# Altium schematic sheet BoardB-Camera.SchDoc
size A; SheetNumber: 7; SheetTotal: 9
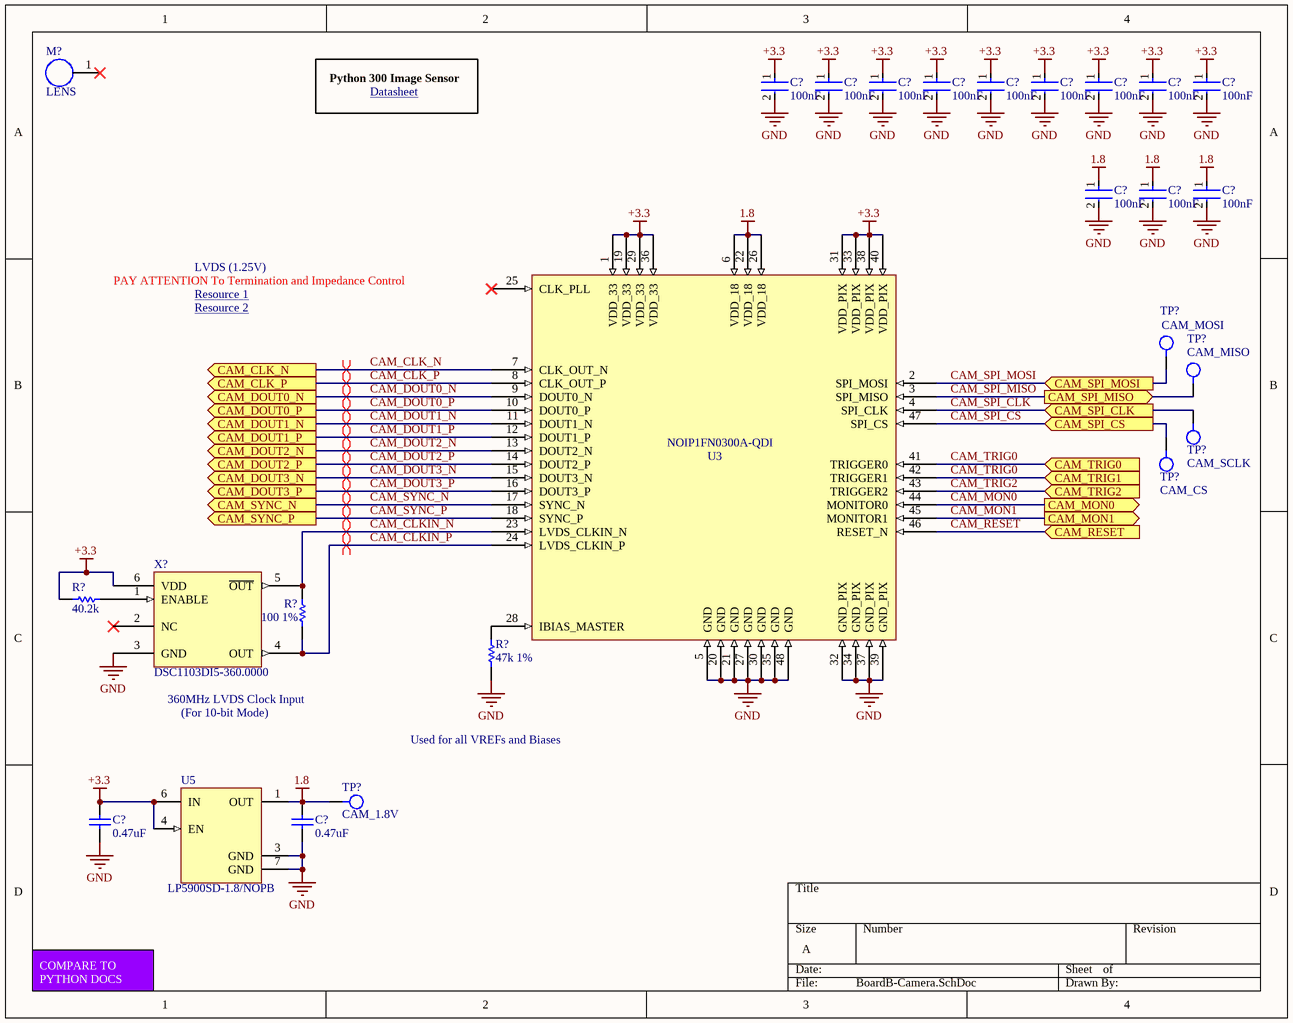
[diagram p0: BoardB-Camera.SchDoc]

## Parts
(Parts that share a designator on the sheet are numbered #1, #2 ... from top to bottom, then left to right.)
C?#1  100nF  [FP-C0402-BB-MFG]
C?#2  100nF  [FP-C0402-BB-MFG]
C?#3  100nF  [FP-C0402-BB-MFG]
C?#4  100nF  [FP-C0402-BB-MFG]
C?#5  100nF  [FP-C0402-BB-MFG]
C?#6  100nF  [FP-C0402-BB-MFG]
C?#7  100nF  [FP-C0402-BB-MFG]
C?#8  100nF  [FP-C0402-BB-MFG]
C?#9  100nF  [FP-C0402-BB-MFG]
C?#10  100nF  [FP-C0402-BB-MFG]
C?#11  100nF  [FP-C0402-BB-MFG]
C?#12  100nF  [FP-C0402-BB-MFG]
C?#13  0.47uF  [CAPC1050X55X10LL05]
C?#14  0.47uF  [CAPC1050X55X10LL05]
M?  LENS  [LENS_MNT]
R?#1  40.2k  [RESC1005X40X25LL05T05]
R?#2  100 1%  [RESC1005X40X25LL05T05]
R?#3  47k 1%  [RESC1005X40X25NL05T05]
TP?#1  CAM_MOSI
TP?#2  CAM_MISO
TP?#3  CAM_SCLK
TP?#4  CAM_CS
TP?#5  CAM_1.8V
U3  NOIP1FN0300A-QDI  [NOIP1FN0300A-QDI]
U5  LP5900SD-1.8/NOPB  [LP5900-WSON]
X?  DSC1103DI5-360.0000  [DSC1103DI5-360.0000]

## Ports
CAM_CLK_N (out), CAM_CLK_P (out), CAM_DOUT0_N (out), CAM_DOUT0_P (out), CAM_DOUT1_N (out), CAM_DOUT1_P (out), CAM_DOUT2_N (out), CAM_DOUT2_P (out), CAM_DOUT3_N (out), CAM_DOUT3_P (out), CAM_MON0 (out), CAM_MON1 (out), CAM_RESET (in), CAM_SPI_CLK (in), CAM_SPI_CS (in), CAM_SPI_MISO (out), CAM_SPI_MOSI (in), CAM_SYNC_N (out), CAM_SYNC_P (out), CAM_TRIG0 (in), CAM_TRIG1 (in), CAM_TRIG2 (in)

## Nets
1.8: C?#10.1 C?#11.1 C?#12.1 C?#14.2 TP?#5.1 U3.6(VDD_18) U3.22(VDD_18) U3.26(VDD_18) U5.1(OUT)
+3.3: C?#1.1 C?#2.1 C?#3.1 C?#4.1 C?#5.1 C?#6.1 C?#7.1 C?#8.1 C?#9.1 C?#13.2 R?#1.1 U3.1(VDD_33) U3.19(VDD_33) U3.29(VDD_33) U3.31(VDD_PIX) U3.33(VDD_PIX) U3.36(VDD_33) U3.38(VDD_PIX) U3.40(VDD_PIX) U5.4(EN) U5.6(IN) X?.6(VDD)
GND: C?#1.2 C?#2.2 C?#3.2 C?#4.2 C?#5.2 C?#6.2 C?#7.2 C?#8.2 C?#9.2 C?#10.2 C?#11.2 C?#12.2 C?#13.1 C?#14.1 R?#3.1 U3.5(GND) U3.20(GND) U3.21(GND) U3.27(GND) U3.30(GND) U3.32(GND_PIX) U3.34(GND_PIX) U3.35(GND) U3.37(GND_PIX) U3.39(GND_PIX) U3.48(GND) U5.3(GND) U5.7(GND) X?.3(GND)
CAM_CLK_N: U3.7(CLK_OUT_N) ; port CAM_CLK_N
CAM_CLK_P: U3.8(CLK_OUT_P) ; port CAM_CLK_P
CAM_CLKIN_N: R?#2.2 U3.23(LVDS_CLKIN_N) X?.5(~{OUT})
CAM_CLKIN_P: R?#2.1 U3.24(LVDS_CLKIN_P) X?.4(OUT)
CAM_DOUT0_N: U3.9(DOUT0_N) ; port CAM_DOUT0_N
CAM_DOUT0_P: U3.10(DOUT0_P) ; port CAM_DOUT0_P
CAM_DOUT1_N: U3.11(DOUT1_N) ; port CAM_DOUT1_N
CAM_DOUT1_P: U3.12(DOUT1_P) ; port CAM_DOUT1_P
CAM_DOUT2_N: U3.13(DOUT2_N) ; port CAM_DOUT2_N
CAM_DOUT2_P: U3.14(DOUT2_P) ; port CAM_DOUT2_P
CAM_DOUT3_N: U3.15(DOUT3_N) ; port CAM_DOUT3_N
CAM_DOUT3_P: U3.16(DOUT3_P) ; port CAM_DOUT3_P
CAM_MON0: U3.44(MONITOR0) ; port CAM_MON0
CAM_MON1: U3.45(MONITOR1) ; port CAM_MON1
CAM_RESET: U3.46(RESET_N) ; port CAM_RESET
CAM_SPI_CLK: TP?#3.1 U3.4(SPI_CLK) ; port CAM_SPI_CLK
CAM_SPI_CS: TP?#4.1 U3.47(SPI_CS) ; port CAM_SPI_CS
CAM_SPI_MISO: TP?#2.1 U3.3(SPI_MISO) ; port CAM_SPI_MISO
CAM_SPI_MOSI: TP?#1.1 U3.2(SPI_MOSI) ; port CAM_SPI_MOSI
CAM_SYNC_N: U3.17(SYNC_N) ; port CAM_SYNC_N
CAM_SYNC_P: U3.18(SYNC_P) ; port CAM_SYNC_P
CAM_TRIG0: U3.41(TRIGGER0) U3.42(TRIGGER1) ; port CAM_TRIG0, port CAM_TRIG1
CAM_TRIG2: U3.43(TRIGGER2) ; port CAM_TRIG2
NetR?#1_2: R?#1.2 X?.1(ENABLE)
NetR?#3_2: R?#3.2 U3.28(IBIAS_MASTER)

Not connected (* = marked no-connect by the designer): M? 1*; U3 25(CLK_PLL)*; X? 2(NC)*

## Layout directives
differential pair; differential pair class CAM_CLK_OUT: CAM_CLK_N, CAM_CLK_P
differential pair; differential pair class CAM_DOUT0: CAM_DOUT0_N, CAM_DOUT0_P
differential pair; differential pair class CAM_DOUT1: CAM_DOUT1_N, CAM_DOUT1_P
differential pair; differential pair class CAM_DOUT2: CAM_DOUT2_N, CAM_DOUT2_P
differential pair; differential pair class CAM_DOUT3: CAM_DOUT3_N, CAM_DOUT3_P
differential pair; differential pair class CAM_SYNC: CAM_SYNC_N, CAM_SYNC_P
differential pair; differential pair class CAM_CLKIN: CAM_CLKIN_N, CAM_CLKIN_P

## Notes on the sheet
- Python 300 Image Sensor
- Datasheet <https://www.onsemi.com/pdf/datasheet/noip1sn1300a-d.pdf>
- PAY ATTENTION To Termination and Impedance Control
- LVDS (1.25V)
- Resource 1 <https://www.xilinx.com/content/dam/xilinx/support/documentation/application_notes/xapp585-lvds-source-synch-serdes-clock-multiplication.pdf>
- Resource 2 <https://support.xilinx.com/s/article/43989?language=en_US>
- (near X?) 360MHz LVDS Clock Input
- (For 10-bit Mode)
- Used for all VREFs and Biases
- COMPARE TO PYTHON DOCS

## Library data of the parts
C?#1-C?#12 = CMP-2008-02046-2: CAP CER 0.1UF 10V X5R 0402; Manufacturer: Kemet; Manufacturer Part Number: C0402C104K8PACTU; Material: Ceramic; Capacitance: 0.10 μF; Temperature Coefficient: 15%; Tolerance: 0.1; Value: 0.10 μF; Package: C0402-BB; Temperature: -55°C to +125°C; ComponentLink2Description: Datasheet; Temperature Characteristic: X5R; Device Class L1: Passive Components; Height: 0.55mm; Lead Free: Yes; ComponentLink2URL: https://content.kemet.com/datasheets/KEM_C1002_X7R_SMD.pdf; Device Class L2: Capacitors; Temperature Range Low: -55°C; Temperature Range High: +125°C; RoHS: TRUE; Octopart: https://octopart.com/c0402c104k8pactu-kemet-140039; Automotive: No; Mouser Description: Capacitor 100 nF 10 VDC 0402; Category: Cap; Voltage Rating: 10 V; Digikey Description: CAP CER 0.1UF 10V X5R 0402; Ipc Land Pattern Name: CAPC10050X50; Device Class L3: Ceramic Capacitors
C?#13 C?#14 = CMP-2000-06003-1: Chip Capacitor, 0.47 uF, +/- 10%, 25 V, -55 to 85 degC, 0402 (1005 Metric), RoHS, Tape and Reel; PCN Part Number: MLCCPartNumberChange30/Nov/2012; Manufacturer: TDK; Kits: 445-9021-KIT-ND / -KITMLCC100PF-10UF04026.3-50V; Capacitance: 0.47µF; Other Names: 445-8020-1; Temperature Coefficient: X5R; Voltage - Rated: 25V; Product Training Modules: CSeriesGeneralApplicationsSEAT,CCV,andTVCLDesignToolsGuidetoReplacinganElectrolyticCapacitorwithanMLCC; EDA / CAD Models: DownloadfromAcceleratedDesigns; Online Catalog: CSeries,GeneralPurpose; Datasheet URL: https://product.tdk.com/info/en/catalog/datasheets/mlcc_commercial_general_en.pdf; Size / Dimension: 0.039"Lx0.020"W(1.00mmx0.50mm); Category: Capacitors; Mounting Technology: SurfaceMount; Mounting Type: SurfaceMount,MLCC; Series: C; RoHS Information: RoHSCertificate-MLCC; Manufacturer URL: http://www.tdk.com/; Packaging: CutTape(CT); Features: LowESL; Package / Case: 0402(1005Metric); Package Reference: 0402; Family: CeramicCapacitors; Tolerance: ±10%; Datasheet Version: 08/2016; Package Description: 2-Pin Surface Mount Device, Body 1.00 x 0.50 mm; Operating Temperature: -55°C~85°C; Standard Package: 1; Applications: GeneralPurpose
M? = LENS_MNT
R?#1 = CMP-2002-00919-1: Manufacturer: Panasonic; Part Number: ERJ-2RKF4022X
R?#2 = CMP-2002-00605-3: Chip Resistor, 100 Ohm, +/- 1%, 100 mW, -55 to 155 degC, 0402 (1005 Metric), RoHS, Tape and Reel; Manufacturer: Basic Passives; PartNumber: ERJ-2RKF1000X; Power Rating: 100 mW; Resistance: 100 Ohm; Voltage Rating: 50 V; Case\/Package: 0402; Width: 0.5 mm; Pins: 2; ComponentLink2Description: Datasheet; PackageReference: 0402; Height: 0.35 mm; Tolerance: 1%; DatasheetVersion: 04/2015; Case Code (Imperial): 0402; Min Operating Temperature: -55 degC; Radiation Hardening: No; Length: 1 mm; Package Quantity: 10000; PackageDescription: 2-Pin Surface Mount Device, Body 1 x 0.5 mm; Mounting Technology: Surface Mount; Case Code (Metric): 1005; Packaging: Tape and Reel; ComponentLink1URL: http://www.panasonic.com/; RoHSCompliant: true; Max Operating Temperature: 155 degC; REACH SVHC: Yes; ComponentLink1Description: Manufacturer URL; ComponentLink2URL: http://industrial.panasonic.com/cdbs/www-data/pdf/RDA0000/AOA0000C86.pdf; Mount: Surface Mount
R?#3 = CMP-2002-01155-1: Part Number: ERJ2RKF4702X; Manufacturer: Panasonic
TP?#1-TP?#5 = TestPoint1mm
U3 = NOIP1FN0300A-QDI: IC IMAGE SENSOR 0.3MP 48LCC; Manufacturer: ON Semiconductor; Operating Supply Voltage: 3.4V; Supplier 1: Avnet; Manufacturer Part Number: NOIP1FN0300A-QDI; RoHS: Yes; Category: Optoelectronics; Pricing 1: 6=58.23675, 8=57.37875, 20=56.62800, 30=55.87725, 60=55.12650, 300=53.83950, 600=53.41050 (USD); Mount: Surface Mount; Case/Package: LCC; Number of Pins: 48; Min Operating Temperature: -40°C; Max Operating Temperature: 85°C; Lead Free: Lead Free; RoHS Compliant: Yes; ComponentLink1URL: http://www.onsemi.com/pub_link/Collateral/PB_NOIP1SN1300A-D.PDF?src-supplier=Digi-Key; ComponentLink1Description: http://www.onsemi.com/pub_link/Collateral/PB_NOIP1SN1300A-D.PDF?src-supplier=Digi-Key; ComponentLink2URL: http://www.onsemi.com/pub_link/Collateral/NOIP1SN1300A-D.PDF?src-supplier=Avnet+Asia; ComponentLink2Description: http://www.onsemi.com/pub_link/Collateral/NOIP1SN1300A-D.PDF?src-supplier=Avnet+Asia; Supplier Part Number 1: NOIP1FN0300A-QDI
U5 = LP5900SD-1.8/NOPB: TEXAS INSTRUMENTS         LP5900SD-1.8/NOPB.             LDO VOLTAGE REGULATOR, 3.3V, 150mA, LLP-6, FULL REEL; Output Voltage: 1.8V; Min Input Voltage: 2.5V; Max Input Voltage: 5.5V; Number of Outputs: 1; Polarity: Positive; Quiescent Current: 50uA; Accuracy: 2%; Output Type: Fixed; Dropout Voltage: 150mV; Supplier 1: Digi-Key; RoHS: Yes; Stock 1: 9836; Pricing 1: 1=0.87000, 10=0.77000, 25=0.72280, 100=0.59000, 250=0.54800, 500=0.46640 (USD); Mount: Surface Mount; Number of Pins: 6; Min Operating Temperature: -40°C; Max Operating Temperature: 125°C; Output Current: 150mA; Package Quantity: 1000; Max Output Current: 150mA; Nominal Output Voltage: 1.8V; Packaging: Tape and Reel; Output Voltage Accuracy: 2%; Length: 2.2mm; Width: 2.5mm; Height: 0.8mm; Radiation Hardening: No; REACH SVHC: No SVHC; Lead Free: Lead Free; RoHS Compliant: Yes; ComponentLink1URL: https://datasheet.ciiva.com/6598/lp5900-6598182.pdf?src-supplier=Digi-Key; ComponentLink1Description: https://datasheet.ciiva.com/6598/lp5900-6598182.pdf?src-supplier=Digi-Key; ComponentLink2URL: https://datasheet.ciiva.com/6598/lp5900-6598185.pdf?src-supplier=Digi-Key; ComponentLink2Description: https://datasheet.ciiva.com/6598/lp5900-6598185.pdf?src-supplier=Digi-Key; ComponentLink3URL: https://datasheet.ciiva.com/6598/lp5900-6598187.pdf?src-supplier=Digi-Key; ComponentLink3Description: https://datasheet.ciiva.com/6598/lp5900-6598187.pdf?src-supplier=Digi-Key; ComponentLink4URL: https://datasheet.ciiva.com/26175/lp5900-26175289.pdf?src-supplier=Avnet+Europe; ComponentLink4Description: https://datasheet.ciiva.com/26175/lp5900-26175289.pdf?src-supplier=Avnet+Europe; ComponentLink5URL: https://datasheet.ciiva.com/14278/lp5900-14278125.pdf?src-supplier=Avnet; ComponentLink5Description: https://datasheet.ciiva.com/14278/lp5900-14278125.pdf?src-supplier=Avnet; ComponentLink6URL: https://datasheet.ciiva.com/28643/1772310-28643116.pdf?src-supplier=Element14; ComponentLink6Description: https://datasheet.ciiva.com/28643/1772310-28643116.pdf?src-supplier=Element14; ComponentLink7URL: https://datasheet.ciiva.com/22678/1772310-22678013.pdf?src-supplier=Element14; ComponentLink7Description: https://datasheet.ciiva.com/22678/1772310-22678013.pdf?src-supplier=Element14; Category: Voltage Regulators - Linear; Manufacturer Part Number: LP5900SD-1.8/NOPB; Manufacturer: Texas Instruments; Supplier Part Number 1: LP5900SD-1.8/NOPBCT-ND
X? = DSC1103DI5-360.0000: Mems Oscillator, Low Power, Lvds, -40C-85C, 10Ppm, 2.5X2.0Mm6 Vdfn 2.0X2.5Mm Tube; Manufacturer: Microchip; Supplier 1: Digi-Key; Manufacturer Part Number: DSC1103DI5-360.0000; RoHS: Yes; Category: Oscillators; Stock 1: 706; Pricing 1: 1=5.51000, 25=4.59000, 100=4.51500 (USD); RoHS Compliant: Yes; Supplier Part Number 1: DSC1103DI5-360.0000-ND